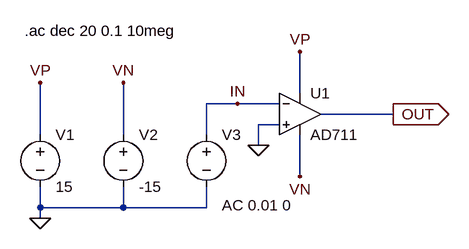
[diagram p0: schematic A2 11.asc]
A2 11.asc, the LTspice schematic file:
Version 4
SHEET 1 880 680
WIRE 160 144 160 80
WIRE 64 160 16 160
WIRE 128 160 64 160
WIRE 304 176 192 176
WIRE 128 192 96 192
WIRE -240 208 -240 128
WIRE -112 208 -112 128
WIRE 16 208 16 160
WIRE 96 224 96 192
WIRE 160 272 160 208
WIRE -240 320 -240 288
WIRE -112 320 -112 288
WIRE -112 320 -240 320
WIRE 16 320 16 288
WIRE 16 320 -112 320
WIRE -240 336 -240 320
FLAG 160 80 VP
FLAG 160 272 VN
FLAG 96 224 0
FLAG -240 336 0
FLAG -240 128 VP
FLAG -112 128 VN
FLAG 64 160 IN
FLAG 304 176 OUT
IOPIN 304 176 Out
SYMBOL OpAmps\\AD711 160 112 R0
SYMATTR InstName U1
SYMBOL voltage -240 192 R0
SYMATTR InstName V1
SYMATTR Value 15
SYMBOL voltage -112 192 R0
SYMATTR InstName V2
SYMATTR Value -15
SYMBOL voltage 16 192 R0
WINDOW 123 24 124 Left 2
WINDOW 39 0 0 Left 0
SYMATTR InstName V3
SYMATTR Value ""
SYMATTR Value2 AC 0.01 0
TEXT -264 48 Left 2 !.ac dec 20 0.1 10meg

The netlist it stands for:
* A2 11.asc
XU1 0 IN VP VN OUT AD712  ; AD711, pins In+ In- V+ V- OUT
V1 VP 0 15
V2 VN 0 -15
V3 IN 0 AC 0.01 0
.ac dec 20 0.1 10meg
.lib ADI1.lib
.backanno
.end

* Results of the author's LTspice run, read from the files saved beside the schematic
* Operating Point, zero values left out:
*   V(vp) = 15 V
*   V(vn) = -15 V
*   I(V3) = -25 pA
*   I(V2) = 4.899 mA
*   I(V1) = -4.899 mA
*   Ix(u1:1) = 25 pA
*   Ix(u1:2) = 25 pA
*   Ix(u1:3) = 4.899 mA
*   Ix(u1:4) = -4.899 mA
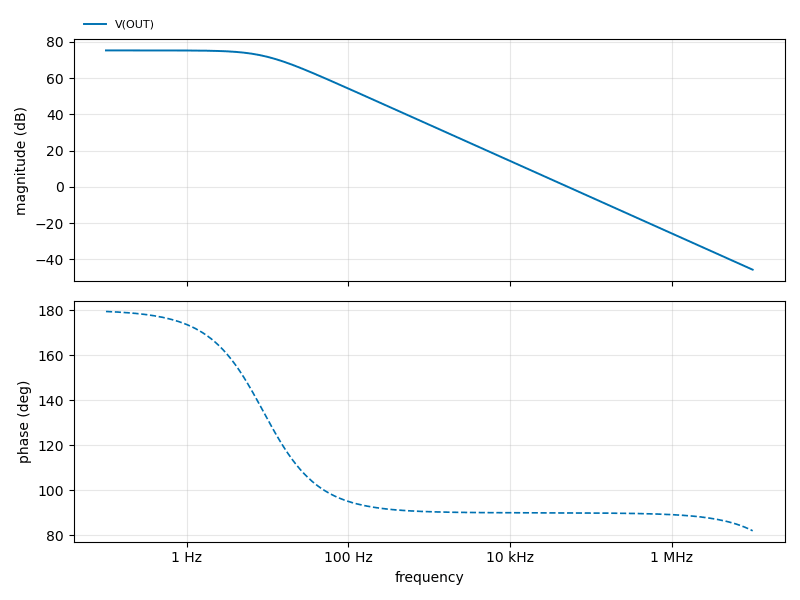
[diagram p1: AC Analysis of A2 11.asc, plotted from the saved traces]
* AC Analysis, 1 run:
*   V(OUT): 75.35 dB at 100 mHz, -45.78 dB at 10 MHz, peak 75.35 dB at 100 mHz, 3 dB below the peak at 8.83 Hz